# Altium schematic sheet upduino_tinymatrix.SchDoc: Upduino Tiny Matrix adapter
size A3; Organization: Blinkinlabs, LLC; SheetNumber: 1; SheetTotal: 1
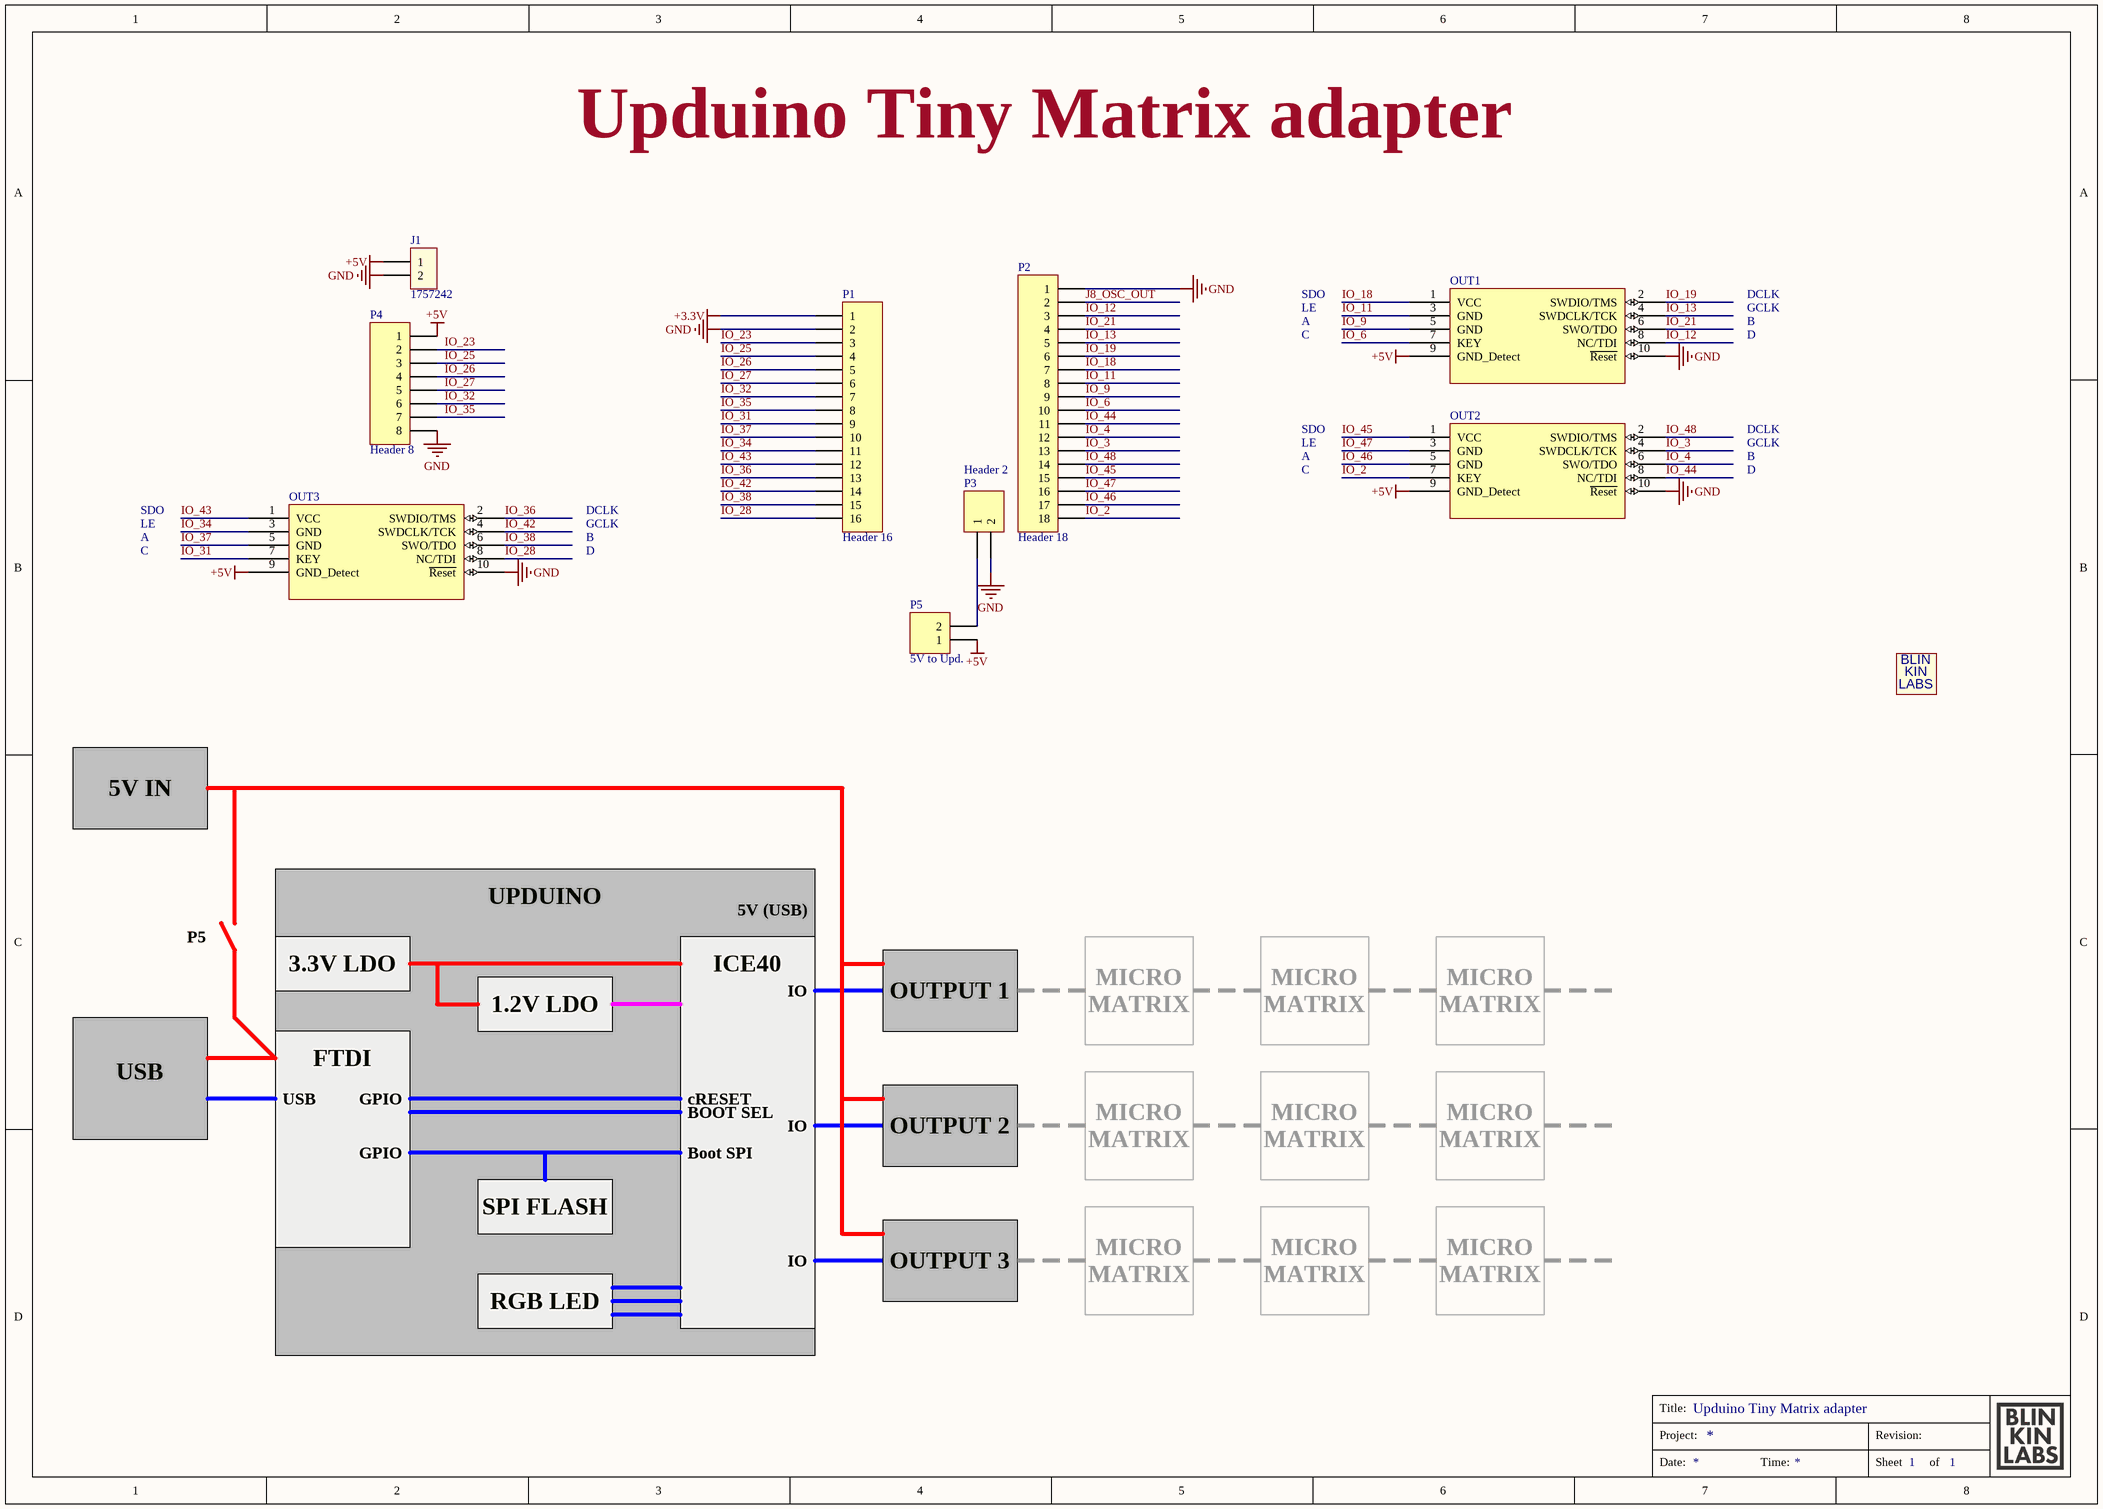
[diagram p0: upduino_tinymatrix.SchDoc]

## Parts
J1  1757242  [1757242]
L?  BLINKINLABS_LOGO  [BLINKINLABS_LOGO]  (value not drawn)  (no BOM)
OUT1  ARM Cortex JTAG  [1.27mm 2x5 SMD Header]
OUT2  ARM Cortex JTAG  [1.27mm 2x5 SMD Header]
OUT3  ARM Cortex JTAG  [1.27mm 2x5 SMD Header]
P1  Header 16  [HDR1X16]
P2  Header 18  [HDR1X18]
P3  Header 2  [HDR1X2]
P4  Header 8  [HDR1X8]
P5  5V to Upd.  [HDR1X2]

## Nets
+3.3V: P1.1
+5V: J1.1 OUT1.9(GND_Detect) OUT2.9(GND_Detect) OUT3.9(GND_Detect) P4.1 P5.1
GND: J1.2 OUT1.10(~{Reset}) OUT2.10(~{Reset}) OUT3.10(~{Reset}) P1.2 P2.1 P3.2 P4.8
IO_2: OUT2.7(KEY) P2.18
IO_3: OUT2.4(SWDCLK/TCK) P2.13
IO_4: OUT2.6(SWO/TDO) P2.12
IO_6: OUT1.7(KEY) P2.10
IO_9: OUT1.5(GND) P2.9
IO_11: OUT1.3(GND) P2.8
IO_12: OUT1.8(NC/TDI) P2.3
IO_13: OUT1.4(SWDCLK/TCK) P2.5
IO_18: OUT1.1(VCC) P2.7
IO_19: OUT1.2(SWDIO/TMS) P2.6
IO_21: OUT1.6(SWO/TDO) P2.4
IO_23: P1.3 P4.2
IO_25: P1.4 P4.3
IO_26: P1.5 P4.4
IO_27: P1.6 P4.5
IO_28: OUT3.8(NC/TDI) P1.16
IO_31: OUT3.7(KEY) P1.9
IO_32: P1.7 P4.6
IO_34: OUT3.3(GND) P1.11
IO_35: P1.8 P4.7
IO_36: OUT3.2(SWDIO/TMS) P1.13
IO_37: OUT3.5(GND) P1.10
IO_38: OUT3.6(SWO/TDO) P1.15
IO_42: OUT3.4(SWDCLK/TCK) P1.14
IO_43: OUT3.1(VCC) P1.12
IO_44: OUT2.8(NC/TDI) P2.11
IO_45: OUT2.1(VCC) P2.15
IO_46: OUT2.5(GND) P2.17
IO_47: OUT2.3(GND) P2.16
IO_48: OUT2.2(SWDIO/TMS) P2.14
J8_OSC_OUT: P2.2
NetP3_1: P3.1 P5.2

## Notes on the sheet
- SDO
- LE
- DCLK
- GCLK
- A
- C
- B
- D
- 5V IN
- UPDUINO
- 5V (USB)
- P5
- 3.3V LDO
- ICE40
- IO
- OUTPUT 1
- MICRO
- FTDI
- 1.2V LDO
- MATRIX
- USB
- GPIO
- cRESET
- BOOT SEL
- OUTPUT 2
- Boot SPI
- SPI FLASH
- OUTPUT 3
- RGB LED
- Title:
- Project:
- Revision:
- Date:
- Time:
- Sheet
- of
- (in symbol BLINKINLABS_LOGO) BLIN; KIN; LABS

## Library data of the parts
J1 = 1757242: TERM BLOCK HDR 2POS 90DEG 5.08MM; Manufacturer: Phoenix Contact; PartNumber: 1757268; ComponentLink2Description: Datasheet; ComponentLink2URL: 1757268_06_en_00.pdf
L? = BLINKINLABS_LOGO: Square logo
OUT1-OUT3 = ARM Cortex JTAG: Arm Cortex 10-pin JTAG connector
P1 = Header 16: Header, 16-Pin; LatestRevisionDate: 17-Jul-2002; LatestRevisionNote: Re-released for DXP Platform.; Publisher: Altium Limited
P2 = Header 18: Header, 18-Pin; LatestRevisionDate: 17-Jul-2002; LatestRevisionNote: Re-released for DXP Platform.; Publisher: Altium Limited
P3 = Header 2: Header, 2-Pin; LatestRevisionDate: 17-Jul-2002; LatestRevisionNote: Re-released for DXP Platform.; Publisher: Altium Limited
P4 = Header 8: Header, 8-Pin; LatestRevisionDate: 17-Jul-2002; LatestRevisionNote: Re-released for DXP Platform.; Publisher: Altium Limited
P5 = Header 2: LatestRevisionDate: 17-Jul-2002; LatestRevisionNote: Re-released for DXP Platform.; Publisher: Altium Limited